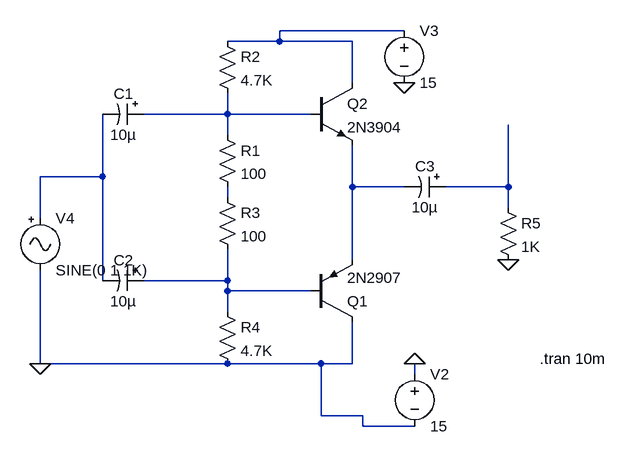
[diagram p0: schematic distortion .asc]
distortion .asc, the LTspice schematic file:
Version 4
SHEET 1 960 704
WIRE 640 48 448 48
WIRE 448 64 448 48
WIRE 448 64 368 64
WIRE 560 64 448 64
WIRE 560 128 560 64
WIRE 368 176 368 144
WIRE 368 176 240 176
WIRE 496 176 368 176
WIRE 368 208 368 176
WIRE 176 272 176 176
WIRE 176 272 80 272
WIRE 560 288 560 224
WIRE 640 288 560 288
WIRE 800 288 800 192
WIRE 800 288 704 288
WIRE 368 304 368 288
WIRE 800 320 800 288
WIRE 80 336 80 272
WIRE 560 400 560 288
WIRE 176 432 176 272
WIRE 368 432 368 384
WIRE 368 432 240 432
WIRE 368 448 368 432
WIRE 496 448 368 448
WIRE 368 480 368 448
WIRE 80 560 80 416
WIRE 368 560 80 560
WIRE 512 560 368 560
WIRE 560 560 560 496
WIRE 560 560 512 560
WIRE 656 576 656 560
WIRE 512 640 512 560
WIRE 576 640 512 640
WIRE 576 656 576 640
WIRE 656 656 576 656
FLAG 80 560 0
FLAG 800 400 0
FLAG 640 128 0
FLAG 656 560 0
SYMBOL polcap 240 160 R90
WINDOW 0 0 32 VBottom 2
WINDOW 3 32 32 VTop 2
SYMATTR InstName C1
SYMATTR Value 10µ
SYMATTR Description Capacitor
SYMATTR Type cap
SYMATTR SpiceLine Rser=4 Lser=0 mfg="AVX" pn="TAJA106M006" type="Tantalum"
SYMBOL polcap 240 416 R90
WINDOW 0 0 32 VBottom 2
WINDOW 3 32 32 VTop 2
SYMATTR InstName C2
SYMATTR Value 10µ
SYMATTR Description Capacitor
SYMATTR Type cap
SYMATTR SpiceLine Rser=4 Lser=0 mfg="AVX" pn="TAJA106M006" type="Tantalum"
SYMBOL polcap 704 272 R90
WINDOW 0 0 32 VBottom 2
WINDOW 3 32 32 VTop 2
SYMATTR InstName C3
SYMATTR Value 10µ
SYMATTR Description Capacitor
SYMATTR Type cap
SYMATTR SpiceLine Rser=4 Lser=0 mfg="AVX" pn="TAJA106M006" type="Tantalum"
SYMBOL res 352 192 R0
SYMATTR InstName R1
SYMATTR Value 100
SYMBOL res 352 48 R0
SYMATTR InstName R2
SYMATTR Value 4.7K
SYMBOL res 352 288 R0
SYMATTR InstName R3
SYMATTR Value 100
SYMBOL res 352 464 R0
SYMATTR InstName R4
SYMATTR Value 4.7K
SYMBOL res 784 304 R0
SYMATTR InstName R5
SYMATTR Value 1K
SYMBOL pnp 496 496 M180
SYMATTR InstName Q1
SYMATTR Value 2N2907
SYMBOL npn 496 128 R0
SYMATTR InstName Q2
SYMATTR Value 2N3904
SYMBOL voltage 656 560 R0
SYMATTR InstName V2
SYMATTR Value 15
SYMBOL voltage 640 32 R0
SYMATTR InstName V3
SYMATTR Value 15
SYMBOL Misc/signal 80 320 R0
SYMATTR InstName V4
TEXT 848 552 Left 2 !.tran 10m

The netlist it stands for:
* distortion .asc
C1 N002 N003 10µ Rser=4 Lser=0 mfg="AVX" pn="TAJA106M006" type="Tantalum"
C2 N007 N003 10µ Rser=4 Lser=0 mfg="AVX" pn="TAJA106M006" type="Tantalum"
C3 N005 N004 10µ Rser=4 Lser=0 mfg="AVX" pn="TAJA106M006" type="Tantalum"
R1 N002 N006 100
R2 N001 N002 4.7K
R3 N006 N007 100
R4 N007 0 4.7K
R5 N005 0 1K
Q1 0 N007 N004 0 2N2907
Q2 N001 N002 N004 0 2N3904
V2 0 0 15
V3 N001 0 15
V4 N003 0 SINE(0 1 1K)
.model NPN NPN
.model PNP PNP
.lib standard.bjt
.tran 10m
.backanno
.end